# Altium schematic sheet Schematic.SchDoc
size OrCAD B; SheetNumber: 2; SheetTotal: 2
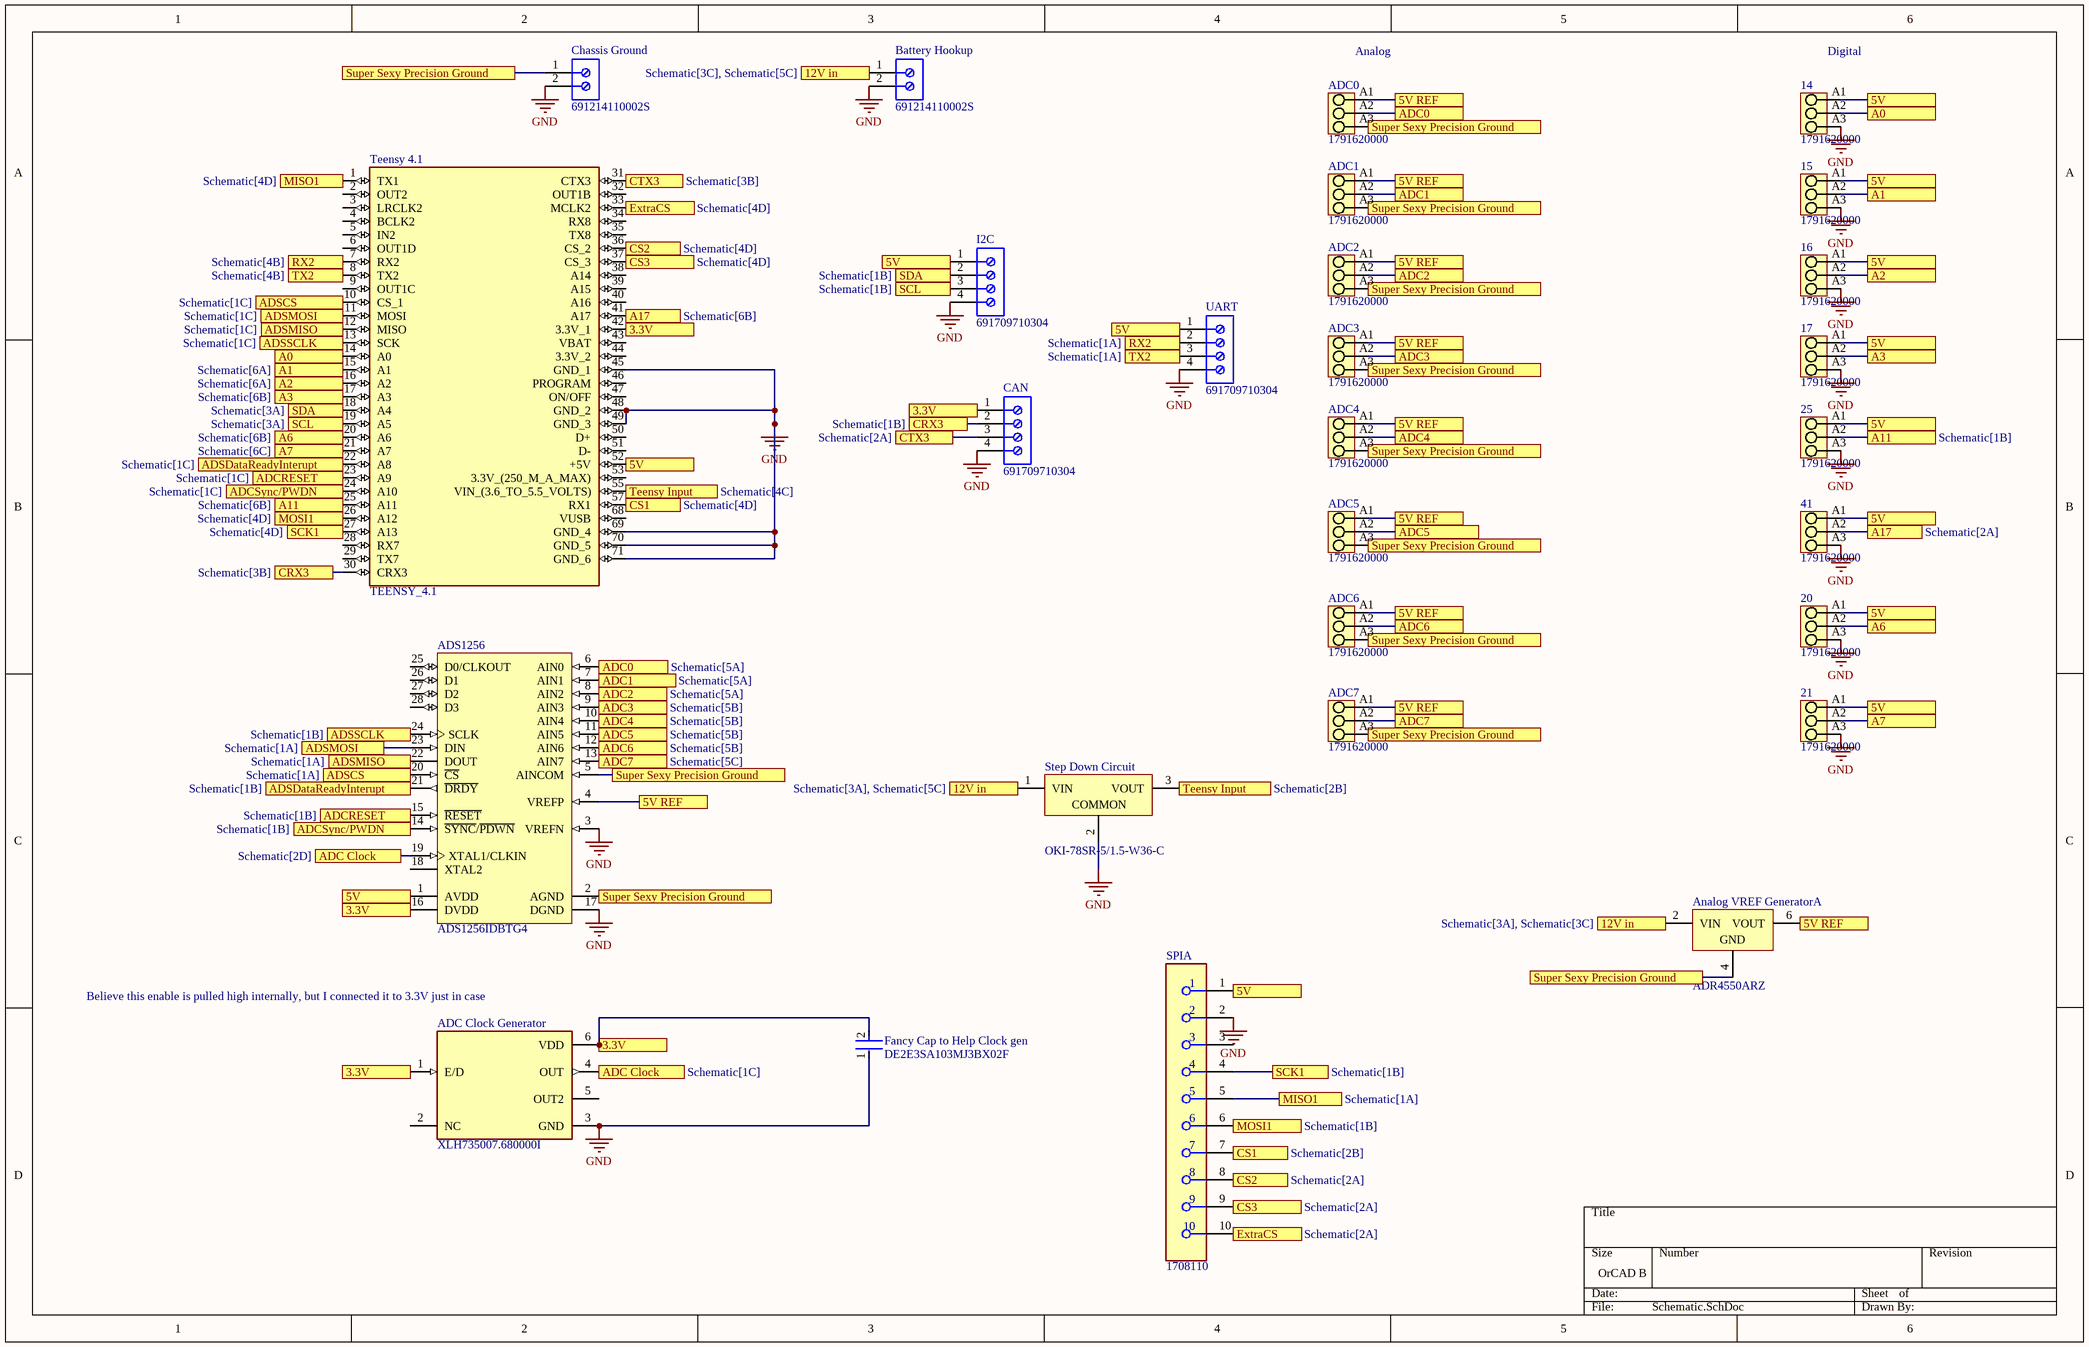
[diagram p0: Schematic.SchDoc]

## Parts
14  1791620000  [PM_5_00_90_03]
15  1791620000  [PM_5_00_90_03]
16  1791620000  [PM_5_00_90_03]
17  1791620000  [PM_5_00_90_03]
20  1791620000  [PM_5_00_90_03]
21  1791620000  [PM_5_00_90_03]
25  1791620000  [PM_5_00_90_03]
41  1791620000  [PM_5_00_90_03]
ADC0  1791620000  [PM_5_00_90_03]
ADC1  1791620000  [PM_5_00_90_03]
ADC2  1791620000  [PM_5_00_90_03]
ADC3  1791620000  [PM_5_00_90_03]
ADC4  1791620000  [PM_5_00_90_03]
ADC5  1791620000  [PM_5_00_90_03]
ADC6  1791620000  [PM_5_00_90_03]
ADC7  1791620000  [PM_5_00_90_03]
ADC_Clock_Generator  XLH735007.680000I  [OSC_XLH735007.680000I3]
ADS1256  ADS1256IDBTG4  [TI-DB28_L]
Analog_VREF_Generator  ADR4550ARZ  [ADI-R-8_N]  (part A of 2)
Battery_Hookup  691214110002S  [691214110002S]
CAN  691709710304  [691709710304]
Chassis_Ground  691214110002S  [691214110002S]
Fancy_Cap_to_Help_Clock_gen  DE2E3SA103MJ3BX02F  [FP-DE2_D15_T5_F7_5_d0_6-0-MFG]
I2C  691709710304  [691709710304]
SPI  1708110  [FP-1708110-MFG]  (part A of 2)
Step_Down_Circuit  OKI-78SR-5/1.5-W36-C  [MURA-OKI-78SR-3]
Teensy_4.1  TEENSY_4.1  [TEENSY41]
UART  691709710304  [691709710304]

## Ports
3.3V (see Schematic[1C], Schematic[1D], Schematic[2A], Schematic[2D]), 3.3V (see Schematic[1C], Schematic[1D], Schematic[2A], Schematic[3B]), 3.3V (see Schematic[1C], Schematic[1D], Schematic[2D], Schematic[3B]), 3.3V (see Schematic[1C], Schematic[2A], Schematic[2D], Schematic[3B]), 3.3V (see Schematic[1D], Schematic[2A], Schematic[2D], Schematic[3B]), 5V (see Schematic[1C], Schematic[2B], Schematic[3A], Schematic[4A], Schematic[4C], Schematic[6A], Schematic[6B]), 5V (see Schematic[1C], Schematic[2B], Schematic[3A], Schematic[4A], Schematic[4C], Schematic[6A], Schematic[6B], Schematic[6C]), 5V (see Schematic[1C], Schematic[2B], Schematic[3A], Schematic[4A], Schematic[6A], Schematic[6B], Schematic[6C]), 5V (see Schematic[1C], Schematic[2B], Schematic[3A], Schematic[4C], Schematic[6A], Schematic[6B], Schematic[6C]), 5V (see Schematic[1C], Schematic[2B], Schematic[4A], Schematic[4C], Schematic[6A], Schematic[6B], Schematic[6C]), 5V (see Schematic[1C], Schematic[3A], Schematic[4A], Schematic[4C], Schematic[6A], Schematic[6B], Schematic[6C]), 5V (see Schematic[2B], Schematic[3A], Schematic[4A], Schematic[4C], Schematic[6A], Schematic[6B], Schematic[6C]), 5V REF (see Schematic[2C], Schematic[5A], Schematic[5B], Schematic[5C]), 5V REF (see Schematic[2C], Schematic[5A], Schematic[5B], Schematic[5C], Schematic[6C]), 5V REF (see Schematic[2C], Schematic[5A], Schematic[5B], Schematic[6C]), 5V REF (see Schematic[5A], Schematic[5B], Schematic[5C], Schematic[6C]), 12V in (see Schematic[3A], Schematic[3C]), 12V in (see Schematic[3A], Schematic[5C]), 12V in (see Schematic[3C], Schematic[5C]), A0 (see Schematic[1B]), A0 (see Schematic[6A]), A1 (see Schematic[1B]), A1 (see Schematic[6A]), A2 (see Schematic[1B]), A2 (see Schematic[6A]), A3 (see Schematic[1B]), A3 (see Schematic[6B]), A6 (see Schematic[1B]), A6 (see Schematic[6B]), A7 (see Schematic[1B]), A7 (see Schematic[6C]), A11 (see Schematic[1B]), A11 (see Schematic[6B]), A17 (see Schematic[2A]), A17 (see Schematic[6B]), ADC0 (see Schematic[2B]), ADC0 (see Schematic[5A]), ADC1 (see Schematic[2C]), ADC1 (see Schematic[5A]), ADC2 (see Schematic[2C]), ADC2 (see Schematic[5A]), ADC3 (see Schematic[2C]), ADC3 (see Schematic[5B]), ADC4 (see Schematic[2C]), ADC4 (see Schematic[5B]), ADC5 (see Schematic[2C]), ADC5 (see Schematic[5B]), ADC6 (see Schematic[2C]), ADC6 (see Schematic[5B]), ADC7 (see Schematic[2C]), ADC7 (see Schematic[5C]), ADC Clock (see Schematic[1C]), ADC Clock (see Schematic[2D]), ADCRESET (see Schematic[1B]), ADCRESET (see Schematic[1C]), ADCSync/PWDN (see Schematic[1B]), ADCSync/PWDN (see Schematic[1C]), ADSCS (see Schematic[1A]), ADSCS (see Schematic[1C]), ADSDataReadyInterupt (see Schematic[1B]), ADSDataReadyInterupt (see Schematic[1C]), ADSMISO (see Schematic[1A]), ADSMISO (see Schematic[1C]), ADSMOSI (see Schematic[1A]), ADSMOSI (see Schematic[1C]), ADSSCLK (see Schematic[1B]), ADSSCLK (see Schematic[1C]), CRX3 (see Schematic[1B]), CRX3 (see Schematic[3B]), CS1 (see Schematic[2B]), CS1 (see Schematic[4D]), CS2 (see Schematic[2A]), CS2 (see Schematic[4D]), CS3 (see Schematic[2A]), CS3 (see Schematic[4D]), CTX3 (see Schematic[2A]), CTX3 (see Schematic[3B]), ExtraCS (see Schematic[2A]), ExtraCS (see Schematic[4D]), MISO1 (see Schematic[1A]), MISO1 (see Schematic[4D]), MOSI1 (see Schematic[1B]), MOSI1 (see Schematic[4D]), RX2 (see Schematic[1A]), RX2 (see Schematic[4B]), SCK1 (see Schematic[1B]), SCK1 (see Schematic[4D]), SCL (see Schematic[1B]), SCL (see Schematic[3A]), SDA (see Schematic[1B]), SDA (see Schematic[3A]), Super Sexy Precision Ground (see Schematic[1A], Schematic[2C], Schematic[4A], Schematic[4B], Schematic[4C]), Super Sexy Precision Ground (see Schematic[1A], Schematic[2C], Schematic[4A], Schematic[4B], Schematic[4C], Schematic[5C]), Super Sexy Precision Ground (see Schematic[1A], Schematic[2C], Schematic[4A], Schematic[4B], Schematic[5C]), Super Sexy Precision Ground (see Schematic[2C], Schematic[4A], Schematic[4B], Schematic[4C], Schematic[5C]), Teensy Input (see Schematic[2B]), Teensy Input (see Schematic[4C]), TX2 (see Schematic[1A]), TX2 (see Schematic[4B])

## Nets
GND: 14.A3 15.A3 16.A3 17.A3 20.A3 21.A3 25.A3 41.A3 ADC_Clock_Generator.3(GND) ADS1256.3(VREFN) ADS1256.17(DGND) Battery_Hookup.2 CAN.4 Chassis_Ground.2 Fancy_Cap_to_Help_Clock_gen.1 I2C.4 SPI.2 Step_Down_Circuit.2(COMMON) Teensy_4.1.45(GND_1) Teensy_4.1.48(GND_2) Teensy_4.1.49(GND_3) Teensy_4.1.69(GND_4) Teensy_4.1.70(GND_5) Teensy_4.1.71(GND_6) UART.4
3.3V: ADC_Clock_Generator.1(E/D) ADC_Clock_Generator.6(VDD) ADS1256.16(DVDD) CAN.1 Fancy_Cap_to_Help_Clock_gen.2 Teensy_4.1.42(3.3V_1) ; port 3.3V
5V: 14.A1 15.A1 16.A1 17.A1 20.A1 21.A1 25.A1 41.A1 ADS1256.1(AVDD) I2C.1 SPI.1 Teensy_4.1.52(+5V) UART.1 ; port 5V
5V REF: ADC0.A1 ADC1.A1 ADC2.A1 ADC3.A1 ADC4.A1 ADC5.A1 ADC6.A1 ADC7.A1 ADS1256.4(VREFP) Analog_VREF_Generator.6(VOUT) ; port 5V REF
12V in: Analog_VREF_Generator.2(VIN) Battery_Hookup.1 Step_Down_Circuit.1(VIN) ; port 12V in
A0: 14.A2 Teensy_4.1.14(A0) ; port A0
A1: 15.A2 Teensy_4.1.15(A1) ; port A1
A2: 16.A2 Teensy_4.1.16(A2) ; port A2
A3: 17.A2 Teensy_4.1.17(A3) ; port A3
A6: 20.A2 Teensy_4.1.20(A6) ; port A6
A7: 21.A2 Teensy_4.1.21(A7) ; port A7
A11: 25.A2 Teensy_4.1.25(A11) ; port A11
A17: 41.A2 Teensy_4.1.41(A17) ; port A17
ADC0: ADC0.A2 ADS1256.6(AIN0) ; port ADC0
ADC1: ADC1.A2 ADS1256.7(AIN1) ; port ADC1
ADC2: ADC2.A2 ADS1256.8(AIN2) ; port ADC2
ADC3: ADC3.A2 ADS1256.9(AIN3) ; port ADC3
ADC4: ADC4.A2 ADS1256.10(AIN4) ; port ADC4
ADC5: ADC5.A2 ADS1256.11(AIN5) ; port ADC5
ADC6: ADC6.A2 ADS1256.12(AIN6) ; port ADC6
ADC7: ADC7.A2 ADS1256.13(AIN7) ; port ADC7
ADC Clock: ADC_Clock_Generator.4(OUT) ADS1256.19(XTAL1/CLKIN) ; port ADC Clock
ADCRESET: ADS1256.15(~{RESET}) Teensy_4.1.23(A9) ; port ADCRESET
ADCSync/PWDN: ADS1256.14(~{SYNC}/~{PDWN}) Teensy_4.1.24(A10) ; port ADCSync/PWDN
ADSCS: ADS1256.20(~{CS}) Teensy_4.1.10(CS_1) ; port ADSCS
ADSDataReadyInterupt: ADS1256.21(~{DRDY}) Teensy_4.1.22(A8) ; port ADSDataReadyInterupt
ADSMISO: ADS1256.22(DOUT) Teensy_4.1.12(MISO) ; port ADSMISO
ADSMOSI: ADS1256.23(DIN) Teensy_4.1.11(MOSI) ; port ADSMOSI
ADSSCLK: ADS1256.24(SCLK) Teensy_4.1.13(SCK) ; port ADSSCLK
CRX3: CAN.2 Teensy_4.1.30(CRX3) ; port CRX3
CS1: SPI.7 Teensy_4.1.57(RX1) ; port CS1
CS2: SPI.8 Teensy_4.1.36(CS_2) ; port CS2
CS3: SPI.9 Teensy_4.1.37(CS_3) ; port CS3
CTX3: CAN.3 Teensy_4.1.31(CTX3) ; port CTX3
ExtraCS: SPI.10 Teensy_4.1.33(MCLK2) ; port ExtraCS
MISO1: SPI.5 Teensy_4.1.1(TX1) ; port MISO1
MOSI1: SPI.6 Teensy_4.1.26(A12) ; port MOSI1
RX2: Teensy_4.1.7(RX2) UART.2 ; port RX2
SCK1: SPI.4 Teensy_4.1.27(A13) ; port SCK1
SCL: I2C.3 Teensy_4.1.19(A5) ; port SCL
SDA: I2C.2 Teensy_4.1.18(A4) ; port SDA
Super Sexy Precision Ground: ADC0.A3 ADC1.A3 ADC2.A3 ADC3.A3 ADC4.A3 ADC5.A3 ADC6.A3 ADC7.A3 ADS1256.2(AGND) ADS1256.5(AINCOM) Analog_VREF_Generator.4(GND) Chassis_Ground.1 ; port Super Sexy Precision Ground
Teensy Input: Step_Down_Circuit.3(VOUT) Teensy_4.1.55(VIN_(3.6_TO_5.5_VOLTS)) ; port Teensy Input
TX2: Teensy_4.1.8(TX2) UART.3 ; port TX2

Not connected (* = marked no-connect by the designer): ADC_Clock_Generator 2(NC) 5(OUT2); ADS1256 18(XTAL2) 25(D0/CLKOUT) 26(D1) 27(D2) 28(D3); SPI 3; Teensy_4.1 2(OUT2) 3(LRCLK2) 4(BCLK2) 5(IN2) 6(OUT1D) 9(OUT1C) 28(RX7) 29(TX7) 32(OUT1B) 34(RX8) 35(TX8) 38(A14) 39(A15) 40(A16) 43(VBAT) 44(3.3V_2) 46(PROGRAM) 47(ON/OFF) 50(D+) 51(D-) 53(3.3V_(250_M_A_MAX)) 68(VUSB)

## Notes on the sheet
- (near ADC0) Analog
- (near 14) Digital
- (near ADC_Clock_Generator) Believe this enable is pulled high internally, but I connected it to 3.3V just in case

## Library data of the parts
14-17 20 21 25 41 ADC0-ADC7 = CMP-1559-01624-1: OMNIMATE Signal - series PM; Manufacturer: Weidmueller; Mounting_onto_the_PCB: Solder connection; Pitch_mm: 5 mm; Solder_pin_length_mm: 3,5 mm; Solid_max_H05_07_V_U: 2,5 mm²; Wire_cross_section_AWG_max_UL_1059: AWG 14; Rated_voltage_use_group_B_UL_1059: 300 V; Pitch_inch: 0,197 inch; UL_94_flammability_rating: V-0; Insulating_material: Wemid (PA); No_of_poles: 3; Solid_min_H05_07_V_U: 0,13 mm²; Contact_material: Cu-Leg; Short_text_for_material: PM 5.00/03/90 3.5SN OR BX; Rated_voltage_for_surge_voltage_class_pollution_degree_II_2: 600 V; Side_termination_characteristic: closed side; Wire_cross_section_AWG_min_UL_1059: AWG 26; Contact_surface: tinned; Rated_current_use_group_B_UL_1059: 15 A; ComponentLink2Description: URL Link1; Revision: V1; Colour: Orange; ComponentLink1URL: http://www.weidmueller.com/; Packaging: Box; Qty: 500 PCS; PackageReference: PM_5_00_90_03; PartNumber: 1791620000; ComponentLink2URL: http://catalog.weidmueller.com/catalog/Start.do?localeId=en&ObjectID=1791620000; ComponentLink1Description: Manufacturer URL
ADC_Clock_Generator = XLH735007.680000I: 7.68 MHz XO (Standard) HCMOS Oscialltor 3.3V Enable/Disable 6-SMD, No Lead (7.50mm x 5.20mm); MF: Renesas Electronics America Inc; SnapEDA_Link: https://www.snapeda.com/parts/XLH735007.680000I/Renesas/view-part/?ref=snap; Package: None; Value: *; MP: XLH735007.680000I; Check_prices: https://www.snapeda.com/parts/XLH735007.680000I/Renesas/view-part/?ref=eda
ADS1256 = CMP-0003-00153-1: 24-Bit, 30 kSPS Very Low Noise Delta-Sigma ADC with Multiplexer, -40 to 85 degC, 28-pin SOP (DB28), Green (RoHS & no Sb/Br); Manufacturer: Texas Instruments; SubFamily: Precision ADC (<=10MSPS); Analog Voltage AV/DD(Min)(V): 4.75; Digital Supply(Max)(V): 3.6; Digital Supply(Min)(V): 1.8; Resolution(Bits): 24; Analog Voltage AV/DD(Max)(V): 5.25; Sample Rate (max)(SPS): 30k; # Input Channels: 8; Interface: Serial SPI; Mounting Technology: Surface Mount; Architecture: Delta-Sigma; DatasheetVersion: SBAS288J; ComponentLink3Description: Package Specification; Eco-Plan: Green (RoHS & no Sb/Br); Code_JEDEC: MO-150; PackageDescription: 28-Pin Plastic Small Outline, Body 10.2 X 5.3 mm, Pitch 0.65 mm; ComponentLink3URL: http://www.ti.com/lit/ml/msso002e/msso002e.pdf; ComponentLink1Description: Manufacturer URL; ComponentLink1URL: http://www.ti.com/; PartNumber: ADS1256IDBTG4; ComponentLink2URL: http://www.ti.com/general/docs/lit/getliterature.tsp?genericPartNumber=ADS1256&fileType=pdf; PackageReference: DB28; PackageVersion: 4040065/E, 12/2001; ComponentLink2Description: Datasheet
Analog_VREF_Generator = CMP-0784-00194-1: Ultralow Noise, High Accuracy Voltage Reference, 5 V Output, 3 to 15 V Supply, Industrial, 8-pin SOIC (R-8), Tube; Manufacturer: Analog Devices; Vout: 5V; Max V Supply (V): 15; Min V Supply (V): 3; Ref Out TC (ppm/C): 4; PackageReference: R-8; PackageDescription: 8-Pin Standard Small Outline Package, Body 4.9 x 3.9 mm, Pitch 1.27 mm; PackageVersion: 060506-A, 06/2006; Operating Temp Range: -40 to 125 degC; DatasheetVersion: Rev. 0; ComponentLink1URL: http://www.analog.com/en/index.html; PartNumber: ADR4550ARZ; Mounting Technology: Surface Mount; ComponentLink2URL: http://www.analog.com/static/imported-files/data_sheets/ADR4520_4525_4530_4533_4540_4550.pdf; ComponentLink2Description: Datasheet; ComponentLink3Description: Package Specification; ComponentLink3URL: http://www.analog.com/static/imported-files/packages/PKG_PDF/SOIC_Narrow%20(R)/R_8.pdf; Packing: Tube; ComponentLink1Description: Manufacturer URL; Code_JEDEC: MS-012-AA; ComponentLink4Description: URL Link1; ComponentLink4URL: Product URL:http://www.analog.com/en/special-linear-functions/voltage-references/adr4550/products/product.html
Battery_Hookup Chassis_Ground = CMP-1502-02465-2: NexarPartId: 94172715; Voltage Rating: 300V; Number of Contacts: 2; Current Rating: 10A; Lead Pitch: 3.5mm; Height: 9.2mm; Min Operating Temperature: -30°C; Number of Pins: 2; Packaging: Box; Max Operating Temperature: 120°C; Contact Material: Nickel, Tin; Number of Rows: 1
CAN I2C UART = CMP-1502-03337-2: NexarPartId: 34171771; Current: 6A; Voltage: 300V; Number of Positions Per Level: 4; Plating: Steel; Wire Gauge (Max): 30AWG; Pitch: 5mm; Connector Type: Screw; Number of Levels: 1; Color: Black; Lead Pitch: 5mm; Mount: Surface Mount; Flammability Rating: UL94 V-0; Termination: Screw; Housing Material: Nylon; Min Operating Temperature: -40°C; REACH SVHC: Unknown; Number of Pins: 4; Contact Plating: Tin; Packaging: Digi-Reel®; Height: 10.2mm; Number of Rows: 1; Number of Positions: 4; Contact Material: Nickel; Current Rating: 6A; Wire Gauge (Min): 30AWG; Voltage Rating: 300V; Length: 20mm; Wire/Cable Gauge: 30AWG; RoHS: Compliant; Number of Contacts: 4; Max Operating Temperature: 130°C
Fancy_Cap_to_Help_Clock_gen = CMP-06035-003835-1: CAP CER
SPI = CMP-00298-00058710-1: 1708110 10 Position Wire to Board Terminal Block Horizontal with Board 0.150" (3.81mm) Through Hole; NexarPartId: 58710; Number of Circuits: 20; Max Current Rating: 10A; Gender: Male; Stripping Length: 5mm; Connector Type: Screw; Voltage: 300V; Number of Poles: 10; Wire Gauge (Min): 26AWG; Wire Gauge (Max): 30AWG; Current Rating: 8A; Number of Levels: 2; Voltage Rating: 200V; Approvals: CB, CSA, UL, cULus; Width: 16.3mm; Ambient Temperature Range High: 105°C; Depth: 16.2mm; Min Operating Temperature: -40°C; Number of Rows: 2; Contact Material: Tin; Termination: Screw; Mount: Through Hole; Housing Color: Green; RoHS: Compliant; Pitch: 3.81mm; Color: Green; Housing Material: Nylon; Insulation Material: Nylon; Number of Contacts: 10; Current: 10A; Max Operating Temperature: 105°C; Number of Positions Per Level: 10; Flammability Rating: UL94 V-0; Length: 38.1mm; Material: Polyamide; Number of Positions: 10; Lead Free: Lead Free; Weight: 1.360777kg; Height: 16.2mm; Number of Pins: 20; Orientation: Straight
Step_Down_Circuit = CMP-2000-05274-1: Non-Isolated DC/DC Converter, 7.5 W, 7 to 36 V, 1.5 A, -40 to 85 degC, 3-Pin THD, RoHS; Manufacturer: Murata; Current - Output (Max): 1.5A; Power (Watts) - Max: 8W; Efficiency: 90.5%; Voltage - Input (Min): 7V; Voltage - Input (Max): 36V; Voltage - Output 1: 5V; Number of Outputs: 1; Package / Case: 3-SIPModule; Features: SCP; Type: LinearRegulatorReplacement; Size / Dimension: 0.41"Lx0.30"Wx0.65"H(10.4mmx7.6mmx16.5mm); Datasheet URL: https://datasheet.ciiva.com/8006/1790439-8006672.pdf; Datasheet Version: Oct-13; Power (Watts) - Manufacture Series: 8W; Voltage - Output 2: -; Series: Okami™OKI-78SR; Family: DCDCConverters; Manufacturer URL: http://www.murata.com/; Category: PowerSupplies-BoardMount; Voltage - Isolation: -; Packaging: Tube; Applications: ITE(Commercial); Mounting Type: ThroughHole; Voltage - Output 3: -; Operating Temperature: -40degC~85degC
Teensy_4.1 = TEENSY_4.1: <b>Teensy 4.1 Development Board</b><p> Source: <a href="https://www.pjrc.com/store/teensy41.html"> Datasheet </a>; MF: PJRC; SnapEDA_Link: https://www.snapeda.com/parts/Teensy%204.1/PJRC/view-part/?ref=snap; Package: None; Value: *; MP: Teensy 4.1; Check_prices: https://www.snapeda.com/parts/Teensy%204.1/PJRC/view-part/?ref=eda